# Altium project Inversor.PrjPcb
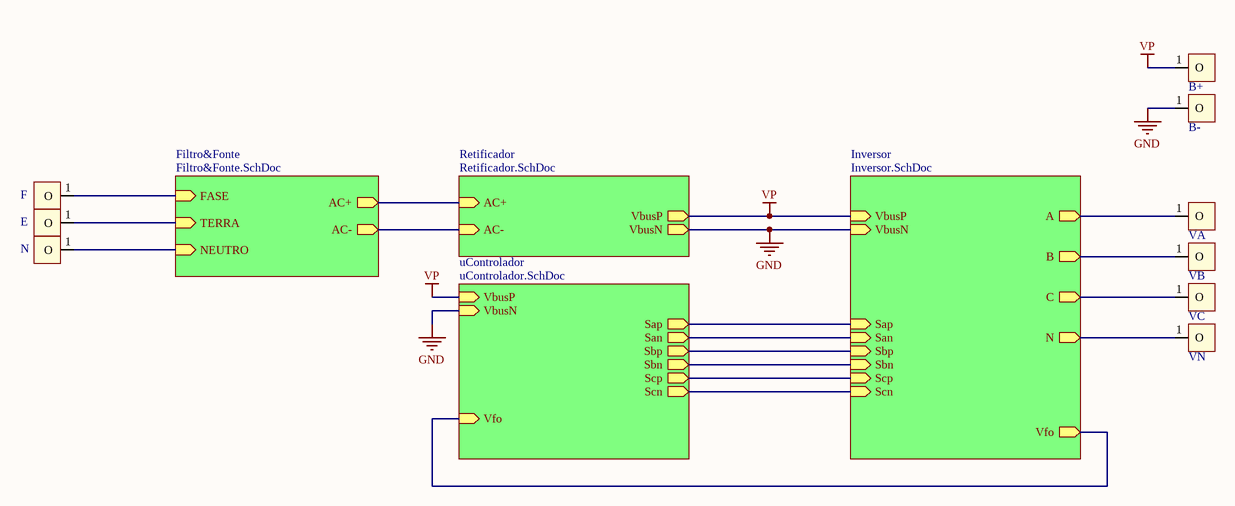
[diagram p0: fonte.SchDoc]
5 sheets, 96 parts. Net scope: hierarchical (ports join the sheet entries above them; power ports are global).
Board file: PCB.PcbDoc
Sheets:
  fonte.SchDoc
    Inversor = Inversor.SchDoc
    uControlador = uControlador.SchDoc
    Retificador = Retificador.SchDoc
    Filtro&Fonte = Filtro&Fonte.SchDoc

## Sheet fonte.SchDoc
size A4

### Parts
B+  PIN  [PIN]  (value not drawn)
B-  PIN  [PIN]  (value not drawn)
E  PIN  [PIN]  (value not drawn)
F  PIN  [PIN]  (value not drawn)
N  PIN  [PIN]  (value not drawn)
VA  PIN  [PIN]  (value not drawn)
VB  PIN  [PIN]  (value not drawn)
VC  PIN  [PIN]  (value not drawn)
VN  PIN  [PIN]  (value not drawn)

### Sub-sheets
Filtro&Fonte = Filtro&Fonte.SchDoc: AC+ (out), AC- (out), FASE (in), TERRA (in), NEUTRO (in)
Inversor = Inversor.SchDoc: A (out), B (out), C (out), VbusP (in), VbusN (in), Sap (in), Sbp (in), San (in), Sbn (in), Scp (in), Scn (in), N (out), Vfo (out)
Retificador = Retificador.SchDoc: VbusP (out), VbusN (out), AC+ (in), AC- (in)
uControlador = uControlador.SchDoc: VbusP (in), VbusN (in), Sap (out), Sbp (out), San (out), Sbn (out), Scp (out), Scn (out), Vfo (in)

### Nets
EARTH: E.1(O) ; sheet Filtro&Fonte/TERRA
GND: B-.1(O) VN.1(O) ; sheet Inversor/VbusN, sheet Inversor/N, sheet uControlador/VbusN, sheet Retificador/VbusN
VP: B+.1(O) ; sheet Inversor/VbusP, sheet uControlador/VbusP, sheet Retificador/VbusP
AC+: sheet Retificador/AC+, sheet Filtro&Fonte/AC+
AC-: N.1(O) ; sheet Retificador/AC-, sheet Filtro&Fonte/AC-, sheet Filtro&Fonte/NEUTRO
FASE: F.1(O) ; sheet Filtro&Fonte/FASE
FAULT: sheet Inversor/Vfo, sheet uControlador/Vfo
San: sheet Inversor/San, sheet uControlador/San
Sap: sheet Inversor/Sap, sheet uControlador/Sap
Sbn: sheet Inversor/Sbn, sheet uControlador/Sbn
Sbp: sheet Inversor/Sbp, sheet uControlador/Sbp
Scn: sheet Inversor/Scn, sheet uControlador/Scn
Scp: sheet Inversor/Scp, sheet uControlador/Scp
Va: VA.1(O) ; sheet Inversor/A
Vb: VB.1(O) ; sheet Inversor/B
Vc: VC.1(O) ; sheet Inversor/C

### Library data of the parts
B+ B- E F N VA VB VC VN = PIN: Generic pin

## Sheet Inversor.SchDoc
size A4
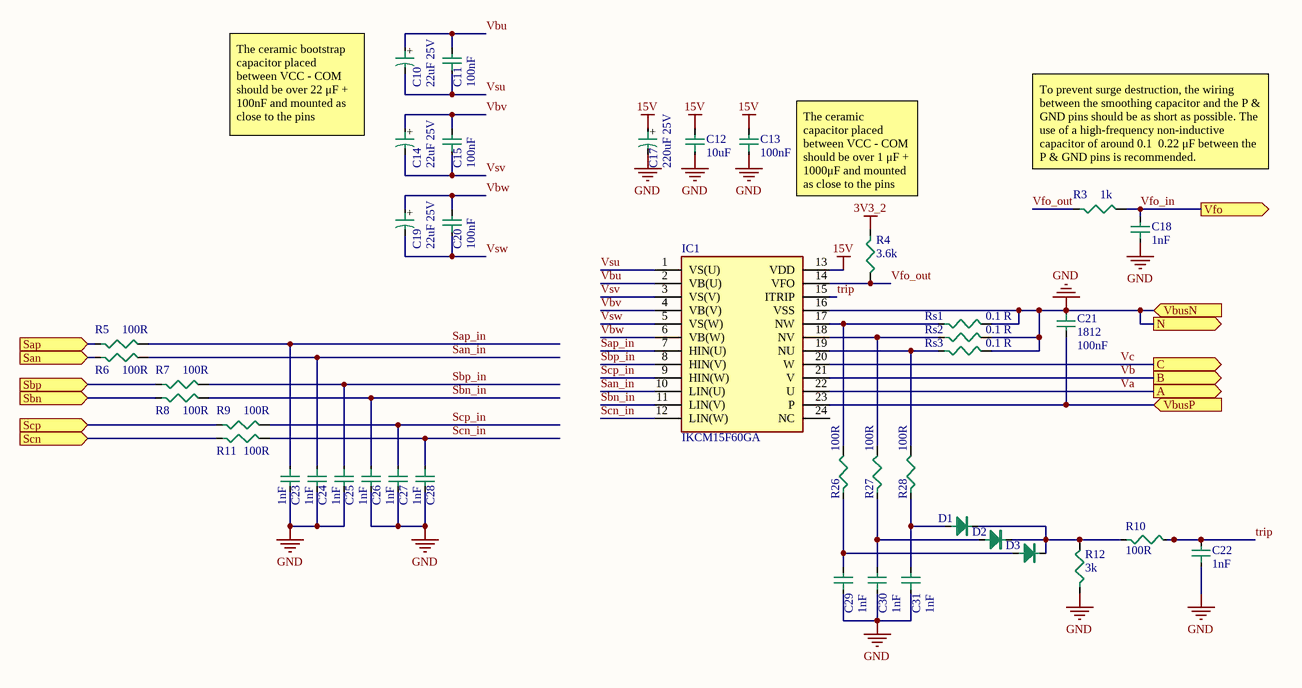
[diagram p1: Inversor.SchDoc]

### Parts
C10  value 22uF 25V  [CAP SMD D5.0 A5.4]  (hidden comment: D5.0 A5.4)
C11  value 100nF  [0805C]  (hidden comment: 0805)
C12  value 10uF  [0805C]  (hidden comment: 0805)
C13  value 100nF  [0805C]  (hidden comment: 0805)
C14  value 22uF 25V  [CAP SMD D5.0 A5.4]  (hidden comment: D5.0 A5.4)
C15  value 100nF  [0805C]  (hidden comment: 0805)
C17  value 220uF 25V  [CAP SMD D8.0 A10.2]  (hidden comment: D8.0 A10.2)
C18  value 1nF  [0805C]  (hidden comment: 0805)
C19  value 22uF 25V  [CAP SMD D5.0 A5.4]  (hidden comment: D5.0 A5.4)
C20  value 100nF  [0805C]  (hidden comment: 0805)
C21  1812  value 100nF  [1812C]
C22  value 1nF  [0805C]  (hidden comment: 0805)
C23  value 1nF  [0805C]  (hidden comment: 0805)
C24  value 1nF  [0805C]  (hidden comment: 0805)
C25  value 1nF  [0805C]  (hidden comment: 0805)
C26  value 1nF  [0805C]  (hidden comment: 0805)
C27  value 1nF  [0805C]  (hidden comment: 0805)
C28  value 1nF  [0805C]  (hidden comment: 0805)
C29  value 1nF  [0805C]  (hidden comment: 0805)
C30  value 1nF  [0805C]  (hidden comment: 0805)
C31  value 1nF  [0805C]  (hidden comment: 0805)
D1  1N4148 SMD  [DIODE SMD LL-34]  (value not drawn)
D2  1N4148 SMD  [DIODE SMD LL-34]  (value not drawn)
D3  1N4148 SMD  [DIODE SMD LL-34]  (value not drawn)
IC1  IKCM15F60GA  [INF-CIPOS MINI]
R3  value 1k  [0805]  (hidden comment: 0805)
R4  value 3.6k  [0805]  (hidden comment: 0805)
R5  value 100R  [0805]  (hidden comment: 0805)
R6  value 100R  [0805]  (hidden comment: 0805)
R7  value 100R  [0805]  (hidden comment: 0805)
R8  value 100R  [0805]  (hidden comment: 0805)
R9  value 100R  [0805]  (hidden comment: 0805)
R10  value 100R  [0805]  (hidden comment: 0805)
R11  value 100R  [0805]  (hidden comment: 0805)
R12  value 3k  [0805]  (hidden comment: 0805)
R26  value 100R  [0805]  (hidden comment: 0805)
R27  value 100R  [0805]  (hidden comment: 0805)
R28  value 100R  [0805]  (hidden comment: 0805)
Rs1  value 0.1 R  [CRA2512]  (hidden comment: Resistor shunt SMD 3 W)
Rs2  value 0.1 R  [CRA2512]  (hidden comment: Resistor shunt SMD 3 W)
Rs3  value 0.1 R  [CRA2512]  (hidden comment: Resistor shunt SMD 3 W)

### Ports
A (out), B (out), C (out), N (out), San (in), Sap (in), Sbn (in), Sbp (in), Scn (in), Scp (in), VbusN (in), VbusP (in), Vfo (out)

### Nets
3V3_2: R4.1
15V: C12.2 C13.2 C17.1 IC1.13(VDD)
GND: C12.1 C13.1 C17.2 C18.1 C21.1 C22.1 C23.2 C24.2 C25.2 C26.2 C27.2 C28.2 C29.1 C30.1 C31.1 IC1.16(VSS) R12.1 Rs1.2 Rs2.2 Rs3.2 ; port VbusN, port N
VP: C21.2 IC1.23(P) ; port VbusP
San: R6.1 ; port San
San_in: C24.1 IC1.10(LIN(U)) R6.2
Sap: R5.1 ; port Sap
Sap_in: C23.1 IC1.7(HIN(U)) R5.2
Sbn: R8.1 ; port Sbn
Sbn_in: C26.1 IC1.11(LIN(V)) R8.2
Sbp: R7.1 ; port Sbp
Sbp_in: C25.1 IC1.8(HIN(V)) R7.2
Scn: R11.1 ; port Scn
Scn_in: C28.1 IC1.12(LIN(W)) R11.2
Scp: R9.1 ; port Scp
Scp_in: C27.1 IC1.9(HIN(W)) R9.2
trip: C22.2 IC1.15(ITRIP) R10.2
Va: IC1.22(U) ; port A
Vb: IC1.21(V) ; port B
Vbu: C10.1 C11.2 IC1.2(VB(U))
Vbv: C14.1 C15.2 IC1.4(VB(V))
Vbw: C19.1 C20.2 IC1.6(VB(W))
Vc: IC1.20(W) ; port C
Vfo_in: C18.2 R3.2 ; port Vfo  [project net FAULT]
Vfo_out: IC1.14(VFO) R3.1 R4.2
Vsu: C10.2 C11.1 IC1.1(VS(U))
Vsv: C14.2 C15.1 IC1.3(VS(V))
Vsw: C19.2 C20.1 IC1.5(VS(W))
NetC29_2: C29.2 D3.A R26.1
NetC30_2: C30.2 D2.A R27.1
NetC31_2: C31.2 D1.A R28.1
NetD1_K: D1.K D2.K D3.K R10.1 R12.2
NetIC1_17: IC1.17(NW) R26.2 Rs1.1
NetIC1_18: IC1.18(NV) R27.2 Rs2.1
NetIC1_19: IC1.19(NU) R28.2 Rs3.1

Not connected (* = marked no-connect by the designer): IC1 24(NC)

### Notes on the sheet
- The ceramic bootstrap capacitor placed between VCC - COM should be over 22 μF + 100nF and mounted as close to the pins
- The ceramic capacitor placed between VCC - COM should be over 1 μF + 1000μF and mounted as close to the pins
- To prevent surge destruction, the wiring between the smoothing capacitor and the P & GND pins should be as short as possible. The use of a high-frequency non-inductive
  capacitor of around 0.1  0.22 μF between the P & GND pins is recommended.
- (in symbol Capacitor SMD D5.0 A5.4) +
- (in symbol Capacitor SMD D8.0 A10.2) +

### Library data of the parts
C10 C14 C19 = Capacitor SMD D5.0 A5.4: %: ±20%
C11-C13 C15 C18 C20 C22-C31 = Capacitor SMD 0805
C17 = Capacitor SMD D8.0 A10.2: %: ±20%
C21 = Capacitor SMD 1812
D1-D3 = Diodo Sinal SMD 1N4148: Diodo Sinal SMD LL-34
IC1 = IKCM15F60GA: Integrated Circuit; Manufacturer_Name: Infineon; Datasheet Link: https://www.infineon.com/dgdl/Infineon-IKCM15F60GA-DS-v02_05-EN.pdf?fileId=5546d4624fb7fef2014fcb43b29e78c1; Manufacturer_Part_Number: IKCM15F60GA; Mouser Part Number: 641-IKCM15F60GA; Mouser Price/Stock: https://www.mouser.co.uk/ProductDetail/Infineon-Technologies/IKCM15F60GA?qs=ZhYpuuF1jLgW0cweeAu4yg%3D%3D
R3-R12 R26-R28 = Resistor SMD 0805 1/8 W: %: ±1%; P: 1/8W
Rs1-Rs3 = Resistor shunt SMD 3 W: Resistor SMD 0805 1/8 W; %: ±1%; P: 3W

## Sheet uControlador.SchDoc
size A4
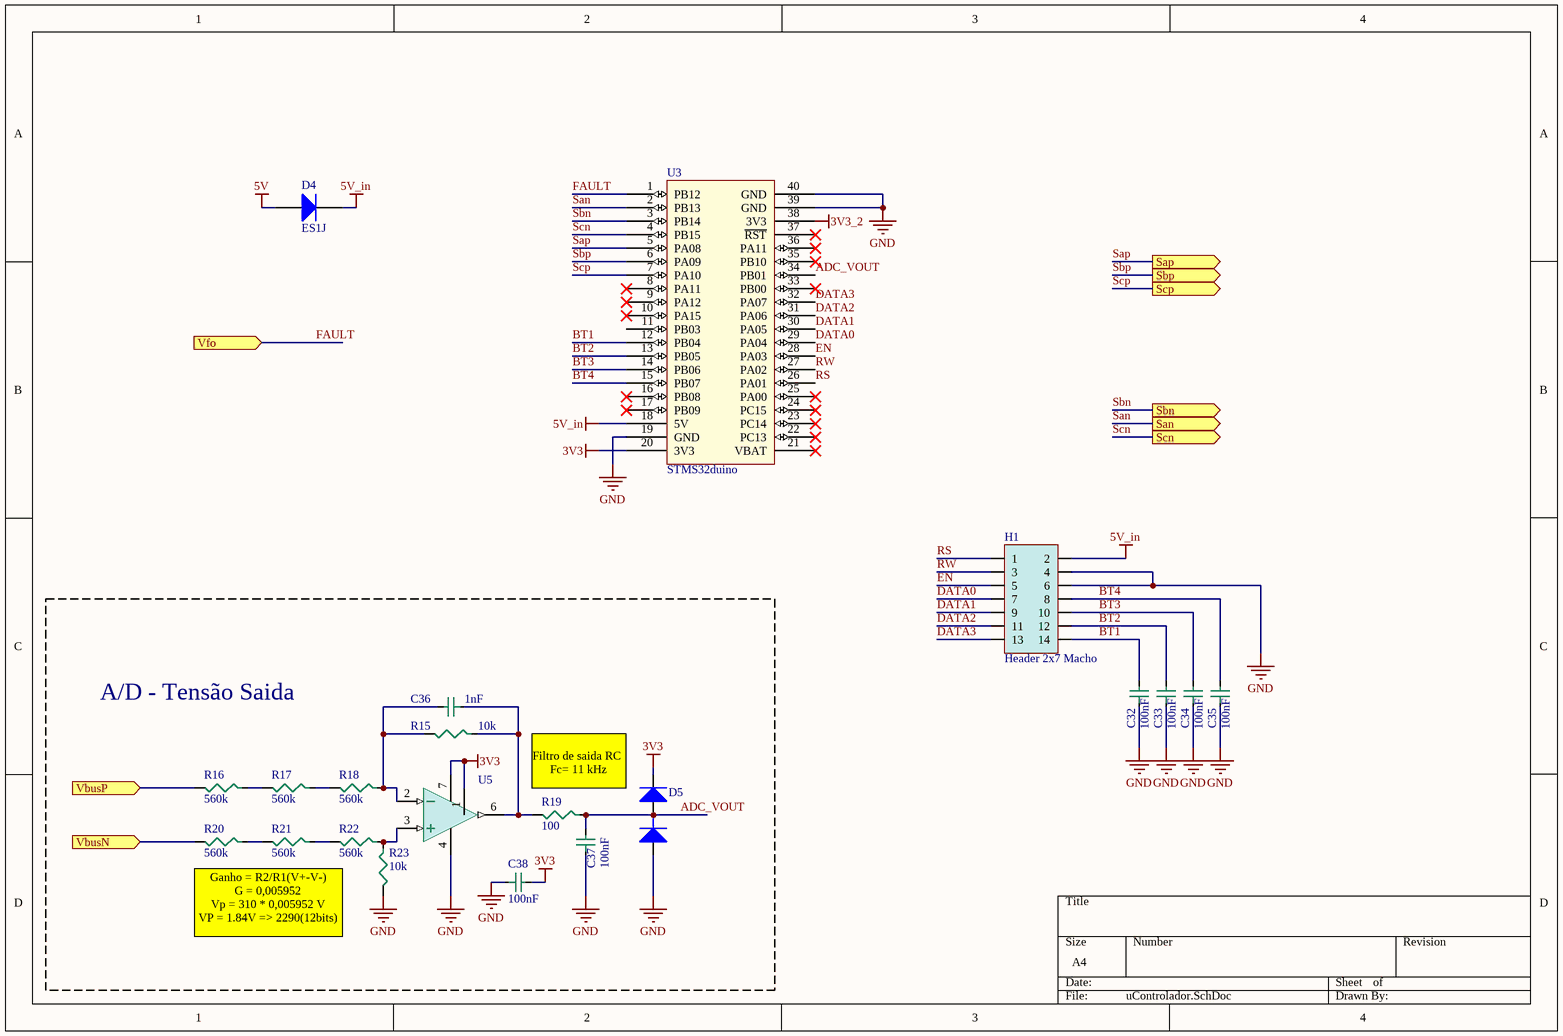
[diagram p2: uControlador.SchDoc]

### Parts
C32  value 100nF  [0805C]  (hidden comment: 0805)
C33  value 100nF  [0805C]  (hidden comment: 0805)
C34  value 100nF  [0805C]  (hidden comment: 0805)
C35  value 100nF  [0805C]  (hidden comment: 0805)
C36  value 1nF  [0805C]  (hidden comment: 0805)
C37  value 100nF  [0805C]  (hidden comment: 0805)
C38  value 100nF  [0805C]  (hidden comment: 0805)
D4  ES1J  [DO-214AC]
D5  Diode BAT54S  [SOT23-3N]  (value not drawn)
H1  Header 2x7 Macho  [HEADER 2X7]
R15  value 10k  [0805]  (hidden comment: 0805)
R16  value 560k  [0805]  (hidden comment: 0805)
R17  value 560k  [0805]  (hidden comment: 0805)
R18  value 560k  [0805]  (hidden comment: 0805)
R19  value 100  [0805]  (hidden comment: 0805)
R20  value 560k  [0805]  (hidden comment: 0805)
R21  value 560k  [0805]  (hidden comment: 0805)
R22  value 560k  [0805]  (hidden comment: 0805)
R23  value 10k  [0805]  (hidden comment: 0805)
U3  STMS32duino  [STM32duino]
U5  MAX4238  [LF351 SOIC 8]  (value not drawn)

### Blocks framed on the sheet
A/D - Tensão Saida: C36-C38 D5 R15-R23 U5

### Ports
San (out), Sap (out), Sbn (out), Sbp (out), Scn (out), Scp (out), VbusN (in), VbusP (in), Vfo (in)

### Nets
3V3: C38.2 D5.2(K) U3.20(3V3) U5.7
3V3_2: U3.38(3V3)
5V: D4.1(A)
5V_in: D4.2(K) H1.2 U3.18(5V)
GND: C32.1 C33.1 C34.1 C35.1 C37.1 C38.1 D5.1(A) H1.4 H1.6 R20.2 R23.2 U3.19(GND) U3.39(GND) U3.40(GND) U5.4 ; port VbusN
VP: R16.2 ; port VbusP
ADC_VOUT: C37.2 D5.3(C) R19.1 U3.34(PB01)
BT1: C32.2 H1.14 U3.12(PB04)
BT2: C33.2 H1.12 U3.13(PB05)
BT3: C34.2 H1.10 U3.14(PB06)
BT4: C35.2 H1.8 U3.15(PB07)
DATA0: H1.7 U3.29(PA04)
DATA1: H1.9 U3.30(PA05)
DATA2: H1.11 U3.31(PA06)
DATA3: H1.13 U3.32(PA07)
EN: H1.5 U3.28(PA03)
FAULT: U3.1(PB12) ; port Vfo
RS: H1.1 U3.26(PA01)
RW: H1.3 U3.27(PA02)
San: U3.2(PB13) ; port San
Sap: U3.5(PA08) ; port Sap
Sbn: U3.3(PB14) ; port Sbn
Sbp: U3.6(PA09) ; port Sbp
Scn: U3.4(PB15) ; port Scn
Scp: U3.7(PA10) ; port Scp
NetC36_1: C36.1 R15.1 R19.2 U5.6
NetC36_2: C36.2 R15.2 R18.1 U5.2
NetR16_1: R16.1 R17.2
NetR17_1: R17.1 R18.2
NetR20_1: R20.1 R21.2
NetR21_1: R21.1 R22.2
NetR22_1: R22.1 R23.1 U5.3

Not connected (* = marked no-connect by the designer): U3 8(PA11)* 9(PA12)* 10(PA15)* 11(PB03) 16(PB08)* 17(PB09)* 21(VBAT)* 22(PC13)* 23(PC14)* 24(PC15)* 25(PA00)* 33(PB00)* 35(PB10)* 36(PA11)* 37(~{RST})*; U5 1(Balance)

### Notes on the sheet
- Filtro de saida RC
  Fc= 11 kHz
- Ganho = R2/R1(V+-V-)
  G = 0,005952
  Vp = 310 * 0,005952 V
  VP = 1.84V => 2290(12bits)

### Library data of the parts
C32-C38 = Capacitor SMD 0805
D4 = Diode ES1J: Rectifiers 1.0 A Ultra Fast Recovery Rect; ComponentLink1Description: MOUSER; ComponentLink1URL: https://br.mouser.com/ProductDetail/512-ES1J; ComponentLink2Description: DATASHEET; ComponentLink2URL: https://br.mouser.com/datasheet/2/308/ES1J-D-1804952.pdf
D5 = BAT54S: Schottky Diodes & Rectifiers SOT23 0.2A 30V Schot tky Dblr; ComponentLink1Description: MOUSER; ComponentLink1URL: https://www.mouser.com/ProductDetail/Rectron/BAT54S?qs=7pEAo90IqNGRiqD7TkybWA%3D%3D; ComponentLink2Description: DATASHEET; ComponentLink2URL: https://www.mouser.com/datasheet/2/345/bat54_a__c__s_-1862106.pdf
R15-R23 = Resistor SMD 0805 1/8 W: %: ±1%; P: 1/8W
U5 = CI Ampop MAX4238: Precision Amplifiers Ultra-Low Offset/Drift, Low-Noise, Precision SOT23 Amplifiers; ComponentLink1Description: MOUSER; ComponentLink1URL: https://www.mouser.com/ProductDetail/Maxim-Integrated/MAX4238ASA%2bT?qs=1eQvB6Dk1vh8%2FaVmoGTf%2FQ%3D%3D; ComponentLink2Description: DATASHEET; ComponentLink2URL: https://www.mouser.com/datasheet/2/256/MAX4238-MAX4239-767304.pdf

## Sheet Retificador.SchDoc
size A4
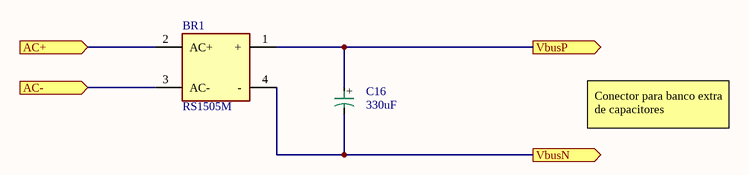
[diagram p3: Retificador.SchDoc]

### Parts
BR1  RS1505M  [RS1505M_BOT]
C16  value 330uF  [CAP ALU D30 A50]  (hidden comment: Cap 30x50 mm)

### Ports
AC+ (in), AC- (in), VbusN (out), VbusP (out)

### Nets
GND: BR1.4(-) C16.2 ; port VbusN
VP: BR1.1(+) C16.1 ; port VbusP
AC+: BR1.2(AC+) ; port AC+
AC-: BR1.3(AC-) ; port AC-

### Notes on the sheet
- Conector para banco extra de capacitores
- (in symbol Capacitor ALU 30x50 mm) +

### Library data of the parts
BR1 = RS1505M: Bridge Rectifier; Manufacturer_Name: Rectron; Datasheet Link: https://www.arrow.com/en/products/rs1505m/rectron; Height: 20.3mm; Manufacturer_Part_Number: RS1505M; Mouser Part Number: 583-RS1505M; Mouser Price/Stock: https://www.mouser.com/Search/Refine.aspx?Keyword=583-RS1505M; Arrow Part Number: RS1505M; Arrow Price/Stock: https://www.arrow.com/en/products/rs1505m/rectron
C16 = Capacitor ALU 30x50 mm: Capacitor 30x50 mm; %: ±20%; Tensão: 200V

## Sheet Filtro&Fonte.SchDoc
size A4
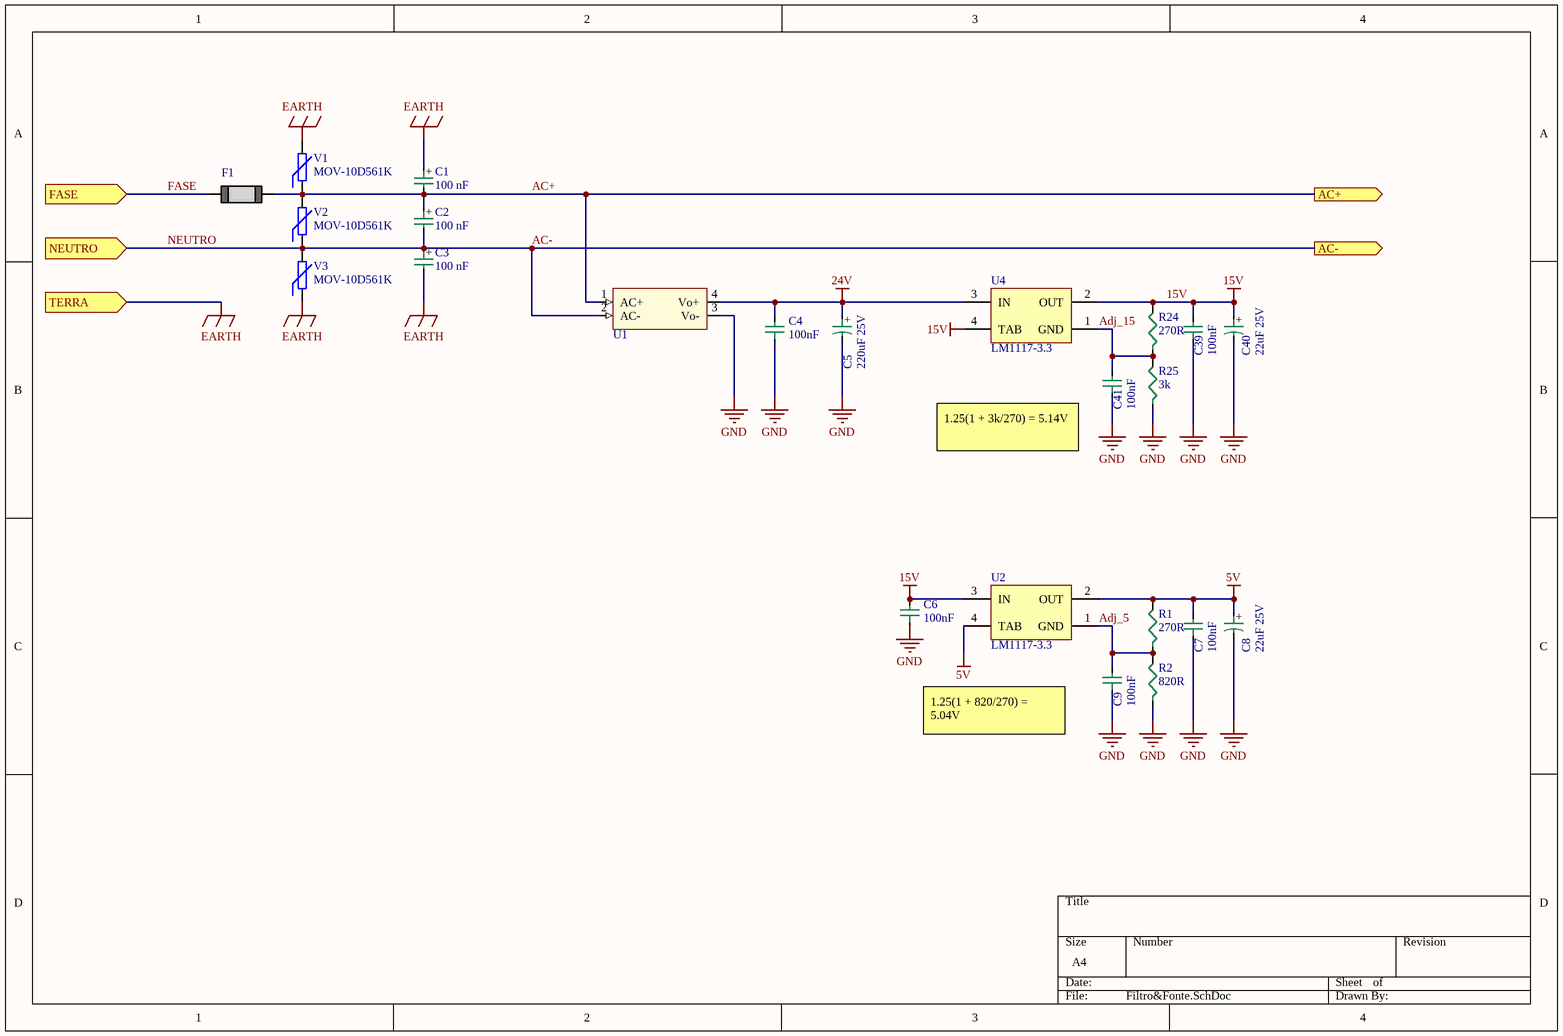
[diagram p4: Filtro&Fonte.SchDoc]

### Parts
C1  value 100 nF  [CAP FILM 10 mm Lead]  (hidden comment: Cap Film 22.5mm)
C2  value 100 nF  [CAP FILM 10 mm Lead]  (hidden comment: Cap Film 22.5mm)
C3  value 100 nF  [CAP FILM 10 mm Lead]  (hidden comment: Cap Film 22.5mm)
C4  value 100nF  [0805C]  (hidden comment: 0805)
C5  value 220uF 25V  [CAP SMD D8.0 A10.2]  (hidden comment: D8.0 A10.2)
C6  value 100nF  [0805C]  (hidden comment: 0805)
C7  value 100nF  [0805C]  (hidden comment: 0805)
C8  value 22uF 25V  [CAP SMD D5.0 A5.4]  (hidden comment: D5.0 A5.4)
C9  value 100nF  [0805C]  (hidden comment: 0805)
C39  value 100nF  [0805C]  (hidden comment: 0805)
C40  value 22uF 25V  [CAP SMD D5.0 A5.4]  (hidden comment: D5.0 A5.4)
C41  value 100nF  [0805C]  (hidden comment: 0805)
F1  5 x 20 mm  [Fuseholder 5 x 20 mm]  (value not drawn)
R1  value 270R  [0805]  (hidden comment: 0805)
R2  value 820R  [0805]  (hidden comment: 0805)
R24  value 270R  [0805]  (hidden comment: 0805)
R25  value 3k  [0805]  (hidden comment: 0805)
U1  5V supply*  [HILINK]  (value not drawn)
U2  LM1117-3.3  [LM1117]
U4  LM1117-3.3  [LM1117]
V1  MOV-10D561K  [VARISTOR 7.5mm]
V2  MOV-10D561K  [VARISTOR 7.5mm]
V3  MOV-10D561K  [VARISTOR 7.5mm]

### Ports
AC+ (out), AC- (out), FASE (in), NEUTRO (in), TERRA (in)

### Nets
5V: C7.2 C8.1 R1.2 U2.2(OUT) U2.4(TAB)
15V: C6.2 C39.2 C40.1 R24.2 U2.3(IN) U4.2(OUT) U4.4(TAB)
24V: C4.2 C5.1 U1.4(Vo+) U4.3(IN)
EARTH: C1.1 C3.2 V1.2 V3.1 ; port TERRA
GND: C4.1 C5.2 C6.1 C7.1 C8.2 C9.1 C39.1 C40.2 C41.1 R2.1 R25.1 U1.3(Vo-)
AC+: C1.2 C2.1 F1.1 U1.1(AC+) V1.1 V2.2 ; port AC+
AC-: C2.2 C3.1 U1.2(AC-) V2.1 V3.2 ; port AC-, port NEUTRO  [also labelled NEUTRO]
Adj_5: C9.2 R1.1 R2.2 U2.1(GND)
Adj_15: C41.2 R24.1 R25.2 U4.1(GND)
FASE: F1.2 ; port FASE

### Notes on the sheet
- (near C41) 1.25(1 + 3k/270) = 5.14V
- 1.25(1 + 820/270) = 5.04V
- (in symbol Capacitor FILM 100nF 275 VAc) +
- (in symbol Capacitor SMD D5.0 A5.4) +
- (in symbol Capacitor SMD D8.0 A10.2) +

### Library data of the parts
C1-C3 = Capacitor FILM 100nF 275 VAc: Safety Capacitors 275VAC 0.1uF 10% LS 10mm X2; %: ±20%; Tensão: 200V; ComponentLink1Description: Mouser; ComponentLink1URL: https://www.mouser.com/ProductDetail/EPCOS-TDK/B32921Y2104K000?qs=TuK3vfAjtkXr4SycMmru8w%3D%3D
C4 C6 C7 C9 C39 C41 = Capacitor SMD 0805
C5 = Capacitor SMD D8.0 A10.2: %: ±20%
C8 C40 = Capacitor SMD D5.0 A5.4: %: ±20%
F1 = FuseHolder 5 x 20 mm: Fuseholder Open Design, 5 x 20 mm; Tensão: 500 VA; Corrente: 16A; DataSheet: https://br.mouser.com/datasheet/2/358/typ_OGN-14523.pdf; 3D Model: https://www.3dcontentcentral.com/secure/download-model.aspx?catalogid=171&id=541358
R1 R2 R24 R25 = Resistor SMD 0805 1/8 W: %: ±1%; P: 1/8W
U1 = HI-LINK PM01 3W: 5V 3W Ultra-small Power Module PM03; ComponentLink1Description: datasheet; ComponentLink1URL: https://datasheet.lcsc.com/szlcsc/1909111105_HI-LINK-HLK-PM24_C399250.pdf
U2 U4 = LM1117IMP-3.3: CI Regulador LM1117IMP-3.3 800mA Low-Dropout Linear Regulator, 4-pin SOT-223; Manufacturer: National Semiconductor; PackageTopMarking: XYTT*N05B; PowerWise: N; CompType: LDO IC; Published: 4-Dec-2008; DatasheetVersion: Apr-2006; PackageVersion: revB, Apr-2003; PackageReference: MP04A; Publisher: Altium Limited; PackageDescription: Molded SOT-223, 6.50 x 3.56 x 1.6mm Body, 4 Lead, 2.3mm Pitch; Supplier 1: Farnell; Supplier Part Number 1: 7614123; PartNumber: LM1117IMP-3.3; RoHS: N; PinCount: 4; Code_JEDEC: TO-261-AA; Code_IPC: SOT223-4; ComponentLink1Description: LM1117 Datasheet; ComponentLink1URL: http://www.national.com/ds/LM/LM1117.pdf; ComponentLink2Description: LM1117 Web Page; ComponentLink2URL: http://www.national.com/pf/LM/LM1117.html; ComponentLink3Description: MP04A Package Page; ComponentLink3URL: http://www.national.com/packaging/folders/mp04a.html
V1-V3 = Varistor: Varistors 180pF 560volts 10%; ComponentLink1Description: MOUSER; ComponentLink1URL: https://www.mouser.com/ProductDetail/Bourns/MOV-10D561K?qs=lgttKnAd%252B2ArrqGQgWwr6w%3D%3D

## Nets that join several sheets
3V3_2: Inversor (R4.1), uControlador (U3.38)
5V: uControlador (D4.1), Filtro&Fonte (5 pins)
15V: Inversor (C12.2 C13.2 C17.1 IC1.13), Filtro&Fonte (7 pins)
EARTH: fonte (E.1), Filtro&Fonte (C1.1 C3.2 V1.2 V3.1)
GND: fonte (B-.1 VN.1), Inversor (20 pins), uControlador (15 pins), Retificador (BR1.4 C16.2), Filtro&Fonte (12 pins)
VP: fonte (B+.1), Inversor (C21.2 IC1.23), uControlador (R16.2), Retificador (BR1.1 C16.1)
AC+: Retificador (BR1.2), Filtro&Fonte (6 pins)
AC-: fonte (N.1), Retificador (BR1.3), Filtro&Fonte (5 pins)
FASE: fonte (F.1), Filtro&Fonte (F1.2)
FAULT: Inversor (C18.2 R3.2), uControlador (U3.1)
San: Inversor (R6.1), uControlador (U3.2)
Sap: Inversor (R5.1), uControlador (U3.5)
Sbn: Inversor (R8.1), uControlador (U3.3)
Sbp: Inversor (R7.1), uControlador (U3.6)
Scn: Inversor (R11.1), uControlador (U3.4)
Scp: Inversor (R9.1), uControlador (U3.7)
Va: fonte (VA.1), Inversor (IC1.22)
Vb: fonte (VB.1), Inversor (IC1.21)
Vc: fonte (VC.1), Inversor (IC1.20)